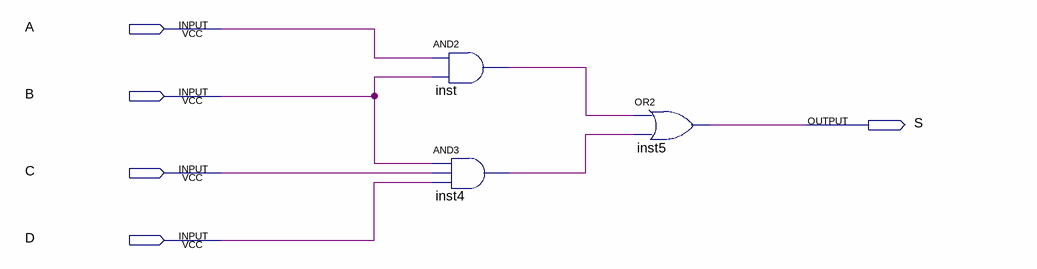
[diagram p0: schematic sheet]
// Quartus schematic tutorial.bdf as structural Verilog: 3 symbols, 5 pins
module tutorial (
  input  A,
  input  B,
  input  C,
  input  D,
  output S
);

  wire inst4_out, inst_out;

  and inst (inst_out, A, B);
  and inst4 (inst4_out, B, C, D);
  or inst5 (S, inst_out, inst4_out);
endmodule
